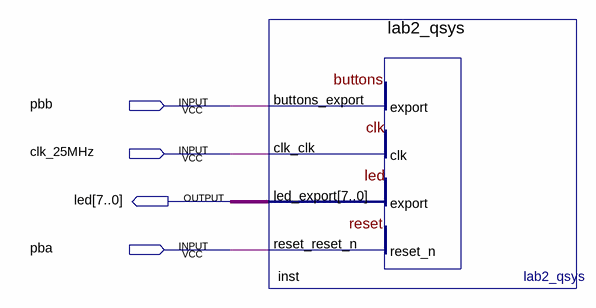
[diagram p0: schematic sheet]
// Quartus schematic lab2.bdf as structural Verilog: 1 symbols, 4 pins
module lab2 (
  input  pbb,
  input  clk_25MHz,
  input  pba,
  output [7:0] led
);

  lab2_qsys inst (.buttons_export(pbb), .clk_clk(clk_25MHz), .reset_reset_n(pba), .led_export(led));
endmodule
